# EAGLE design ziffy_board_v5 (EAGLE 6.5.0)
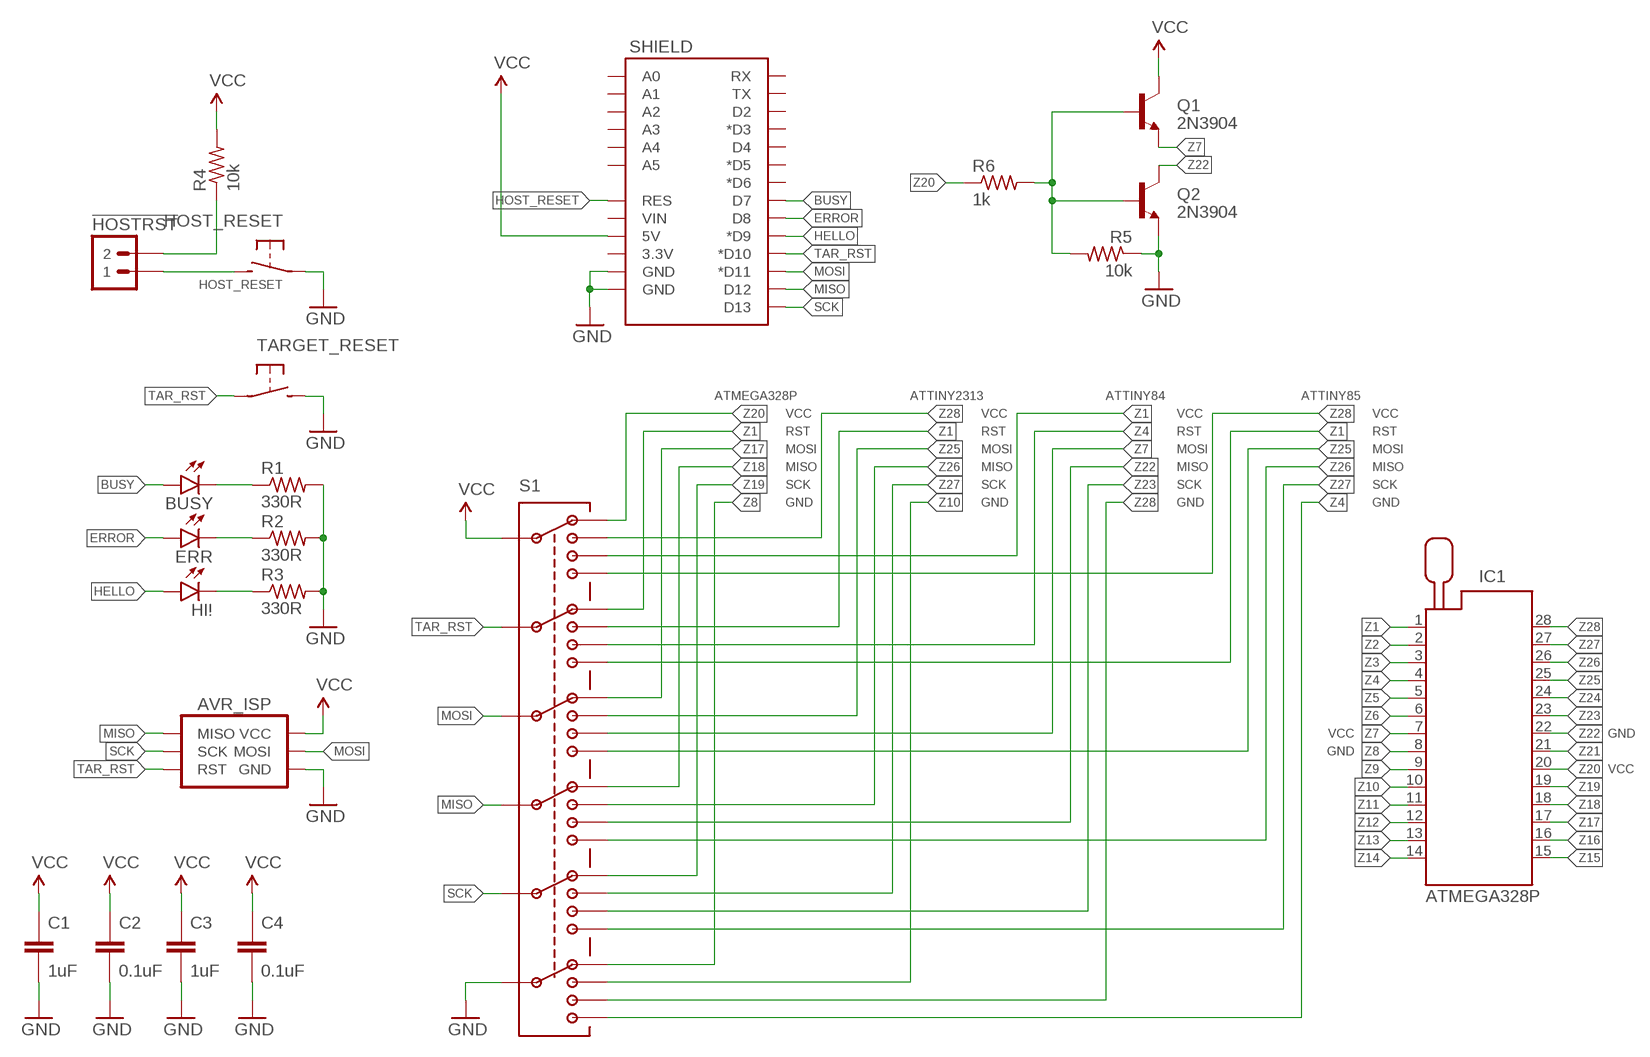
[diagram p0: schematic, sheet 1]

## Parts
!HOSTRST  M02PTH  [1X02]
AVR_ISP  AVR_SPI_PRG_6PTH-SHROUD  [2X3-SHROUDED]
BUSY  YELLOW  LED3MM  [LED3MM]
C1  1uF  CAPACITOR-CERAMIC025-024X044  [C025-024X044]
C2  0.1uF  CAPACITOR-CERAMIC025-024X044  [C025-024X044]
C3  1uF  CAPACITOR-CERAMIC025-024X044  [C025-024X044]
C4  0.1uF  CAPACITOR-CERAMIC025-024X044  [C025-024X044]
ERR  RED  LED3MM  [LED3MM]
HI!  GREEN  LED3MM  [LED3MM]
HOST_RESET  SPST-NO-TACT6MM-PTH-SMALL-PADS  [DTS-6-SMALL-PADS]
IC1  ATMEGA328P  ZIF28  [ZIF28]
Q1  2N3904  TRANSISTOR_NPNTO-92-AMMO-EBC  [TO-92-AMMO]
Q2  2N3904  TRANSISTOR_NPNTO-92-AMMO-EBC  [TO-92-AMMO]
R1  330R  RESISTORPTH-AXIAL-6.35MM  [RESISTOR-AXIAL-PTH-6.35MM]
R2  330R  RESISTORPTH-AXIAL-6.35MM  [RESISTOR-AXIAL-PTH-6.35MM]
R3  330R  RESISTORPTH-AXIAL-6.35MM  [RESISTOR-AXIAL-PTH-6.35MM]
R4  10k  RESISTORPTH-AXIAL-6.35MM  [RESISTOR-AXIAL-PTH-6.35MM]
R5  10k  RESISTORPTH-AXIAL-6.35MM  [RESISTOR-AXIAL-PTH-6.35MM]
R6  1k  RESISTORPTH-AXIAL-6.35MM  [RESISTOR-AXIAL-PTH-6.35MM]
S1  SWITCH-6P4TASDFADSFSD  [SWITCH-6P4T-2MMPTH]
SHIELD  ARDUINO_SHIELD_SMALLER  [ARDUINO_SHIELD_NOOUTLINE_INSIDE_SMALLER]
TARGET_RESET  SPST-NO-TACT6MM-PTH-SMALL-PADS  [DTS-6-SMALL-PADS]

## Nets
BUSY: BUSY.A SHIELD.D7
ERROR: ERR.A SHIELD.D8
GND: AVR_ISP.6(GND) C1.2 C2.2 C3.2 C4.2 HOST_RESET.1 HOST_RESET.2 Q2.1(E) R1.P$2 R2.P$2 R3.P$2 R5.P$1 S1.P28 SHIELD.GND@0(GND) SHIELD.GND@1(GND) TARGET_RESET.3 TARGET_RESET.4
HELLO: HI!.A SHIELD.D9(*D9)
HOST_RESET: !HOSTRST.1 HOST_RESET.3 HOST_RESET.4 SHIELD.RES
MISO: AVR_ISP.1(MISO) S1.P18 SHIELD.D12
MOSI: AVR_ISP.4(MOSI) S1.P13 SHIELD.D11(*D11)
N$1: BUSY.K(C) R1.P$1
N$2: ERR.K(C) R2.P$1
N$3: HI!.K(C) R3.P$1
N$4: !HOSTRST.2 R4.P$1
N$21: Q1.2(B) Q2.2(B) R5.P$2 R6.P$2
SCK: AVR_ISP.3(SCK) S1.P23 SHIELD.D13
TAR_RST: AVR_ISP.5(RST) S1.P8 SHIELD.D10(*D10) TARGET_RESET.1 TARGET_RESET.2
VCC: AVR_ISP.2(VCC) C1.1 C2.1 C3.1 C4.1 Q1.3(C) R4.P$2 S1.P3 SHIELD.5V
Z1: IC1.1 S1.P4 S1.P6 S1.P7 S1.P10
Z2: IC1.2
Z3: IC1.3
Z4: IC1.4 S1.P9 S1.P30
Z5: IC1.5
Z6: IC1.6
Z7: IC1.7 Q1.1(E) S1.P14
Z8: IC1.8 S1.P26
Z9: IC1.9
Z10: IC1.10 S1.P27
Z11: IC1.11
Z12: IC1.12
Z13: IC1.13
Z14: IC1.14
Z15: IC1.15
Z16: IC1.16
Z17: IC1.17 S1.P11
Z18: IC1.18 S1.P16
Z19: IC1.19 S1.P21
Z20: IC1.20 R6.P$1 S1.P1
Z21: IC1.21
Z22: IC1.22 Q2.3(C) S1.P19
Z23: IC1.23 S1.P24
Z24: IC1.24
Z25: IC1.25 S1.P12 S1.P15
Z26: IC1.26 S1.P17 S1.P20
Z27: IC1.27 S1.P22 S1.P25
Z28: IC1.28 S1.P2 S1.P5 S1.P29
Unconnected: SHIELD.3.3V SHIELD.A0 SHIELD.A1 SHIELD.A2 SHIELD.A3 SHIELD.A4 SHIELD.A5 SHIELD.D2 SHIELD.D3(*D3) SHIELD.D4 SHIELD.D5(*D5) SHIELD.D6(*D6) SHIELD.RX SHIELD.TX SHIELD.VIN

## Notes on the sheet
- ATMEGA328P | ATTINY2313 | ATTINY84 | ATTINY85
- VCC | VCC | VCC | VCC
- RST | RST | RST | RST
- MOSI | MOSI | MOSI | MOSI
- MISO | MISO | MISO | MISO
- SCK | SCK | SCK | SCK
- GND | GND | GND | GND
- VCC | GND
- GND
- VCC

## Library data of the parts
!HOSTRST = A_butts:M02: Standard 2-pin 0.1" header. Use with - straight break away headers ( PRT-00116) - right angle break away headers (PRT-00553) - swiss pins (PRT-00743) - machine pins (PRT-00117) - female headers (PRT-00115) Molex polarized connector foot print use with: PRT-08233 with associated crimp pins and housings. 2.54_SCREWTERM for use with PRT-10571. 3.5mm Screw Terminal footprints for PRT-08084 5mm Screw Terminal footprints for use with PRT-08433
AVR_ISP = A_butts:AVR_SPI_PRG_6: AVR ISP 6 Pin This is the reduced ISP connector for AVR programming. Common on Arduino. This footprint will take up less PCB space and can be used with a 10-pin to 6-pin adapter such as SKU: BOB-08508 **Special note about "TEST_POINT" package. The stop mask is on the top side, so if you want your programming test points to be on the bottom of your board, make sure to place this package on the bottom side of the board. This also ensure that the orientation to program from the bottom side will be correct.
BUSY ERR HI! = A_butts:LED: LEDs Standard schematic elements and footprints for 5mm, 3mm, 1206, and 0603 sized LEDs. 5mm - Spark Fun Electronics SKU : COM-00529 (and others)
C1-C4 = A_butts:CAPACITOR-CERAMIC: CAPACITOR, European symbol
HOST_RESET TARGET_RESET = A_butts:SPST-NO-TACT
IC1 = A_butts:ZIF28: Zero Insertion Force Socked Source: http://www.3M.com/ehpd
Q1 Q2 = A_butts:TRANSISTOR_NPN: Generic NPN BJT MMBT2222A - TRANS-08049 (SOT-23, 1A 40V) MPSA42 - TRANS-09116 (SOT-23, 500mA 300V) MMBT5088LT1G - TRANS-11160 (SOT-23, 50 mA 30V) BC547 - COM-08928 <http://www.sparkfun.com/products/8928> (TO-92 45V 100mA) (1.Collector 2.Base 3.Emitter) 2N3904 - COM-00521 <http://www.sparkfun.com/products/521> (TO-92 40V 200mA) (1.Emitter 2.Base 3.Collector) P2N2222A - COM-12852 <http://www.sparkfun.com/products/12852> (TO-92 40V 600mA) (1.Collector 2.Base 3.Emitter)
R1-R6 = A_butts:RESISTOR: RESISTOR, American symbol
S1 = A_butts:SWITCH-6P4T
SHIELD = A_butts:ARDUINO_SHIELD_SMALLER

## Board
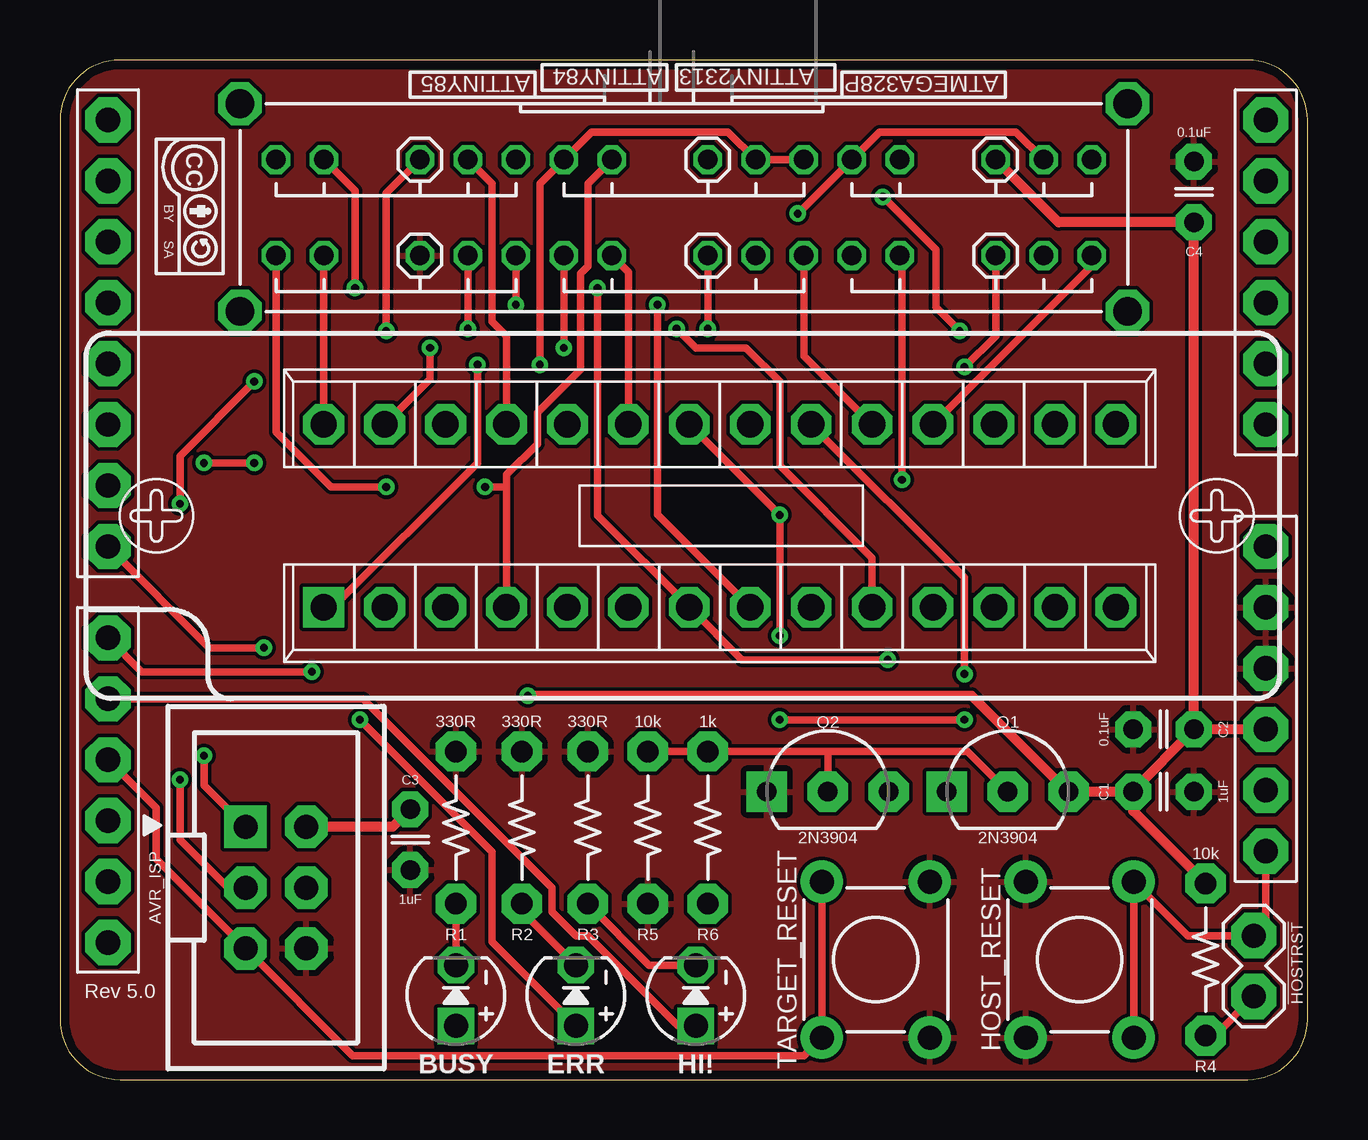
[diagram p1: board, top side]
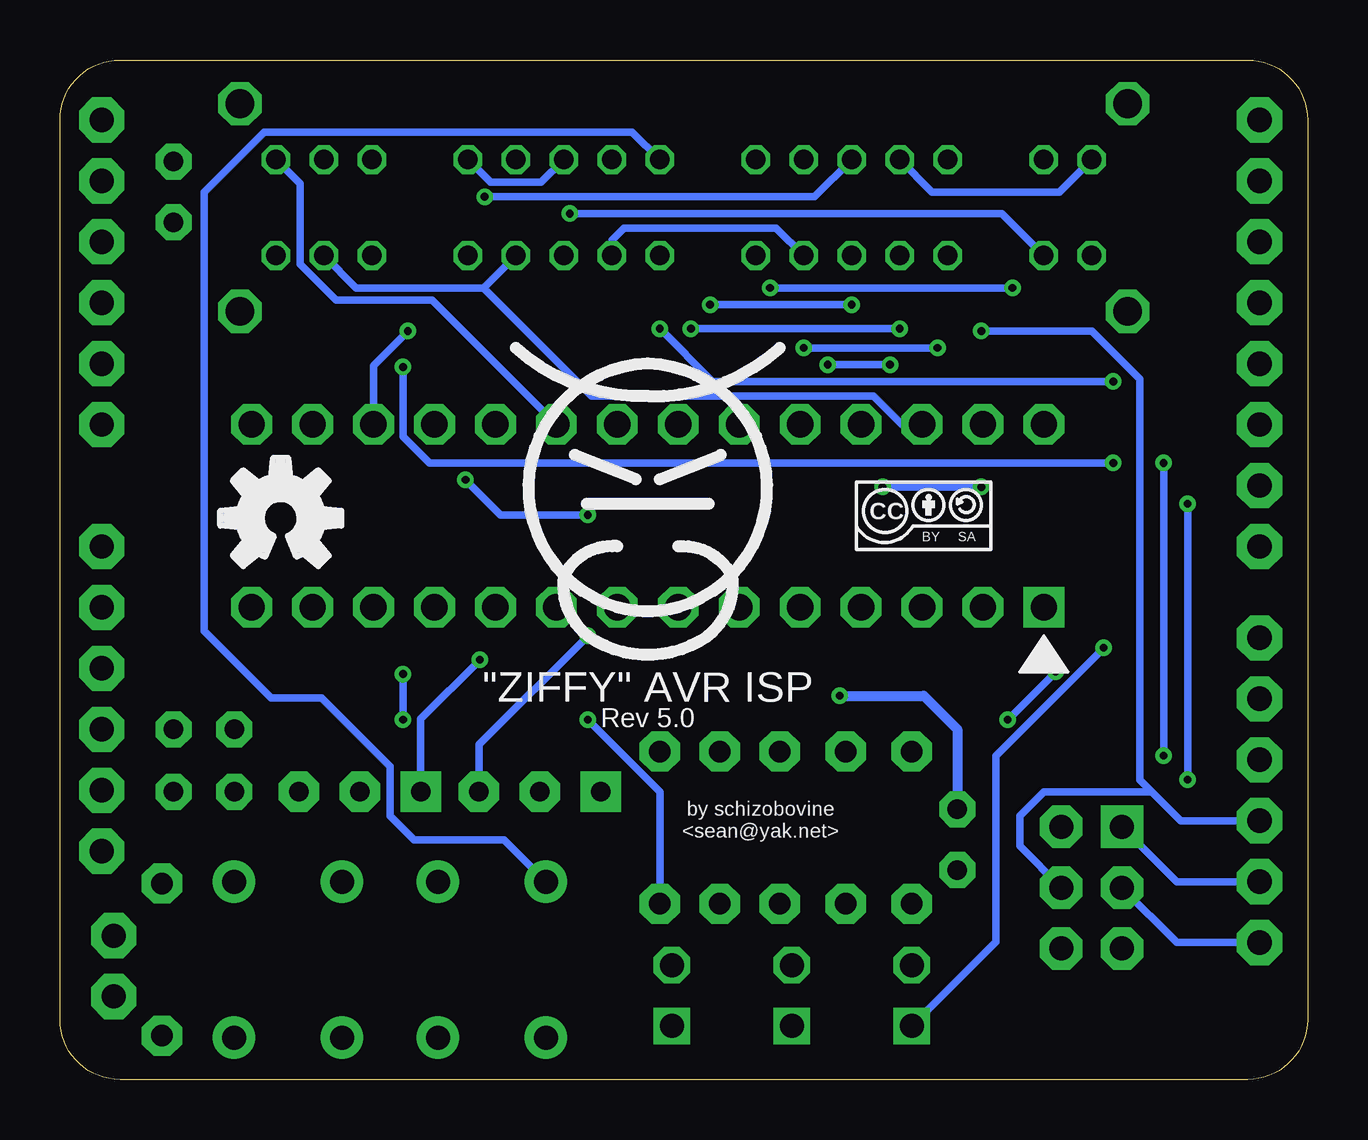
[diagram p2: board, bottom side, seen from below]

Size 52 x 42.5 mm. Coordinates in mm from the lower left corner, seen from the top.
Outline: 0,40 0,2.5 arc90 2.5,0 49.5,0 arc90 52,2.5 52,40 arc90 49.5,42.5 2.5,42.5 arc90 0,40
Copper layers (1*16): Top 0.0356mm / dielectric 1.5011mm / Bottom 0.0356mm
Design rules "LaenPCBOrder_2": minimum track width 6mil, minimum drill 13mil, track to track 6mil, track to pad 6mil, pad to pad 6mil, via to via 6mil, smd to smd 6mil, copper to edge 15mil, drill to drill 6mil, minimum pad ring 7mil, minimum via ring 7mil, stop-mask expansion 3mil, vias tented up to drill 20mil, thermal gap 10mil

### Footprints (pad centres in the part's own frame; a part is rotated, then mirrored left to right if it is on the bottom)
1X02 = drill 1 pad 1.88 octagon: 1 0,0; 2 2.54,0
2X3-SHROUDED = drill 1 pad 1.778 square: 1 -1.27,2.54 | drill 1 pad 1.778 octagon: 2 1.27,2.54; 3 -1.27,0; 4 1.27,0; 5 -1.27,-2.54; 6 1.27,-2.54
LED3MM = drill 1 pad 1.524 square: A -1.27,0 | drill 1 pad 1.524 octagon: K 1.27,0
C025-024X044 = drill 0.813 pad 1.5 octagon: 1 -1.27,0; 2 1.27,0
DTS-6-SMALL-PADS = drill 1 pad 1.778: 1 -3.25,2.25; 2 3.25,2.25; 3 -3.25,-2.25; 4 3.25,-2.25
ZIF28 = drill 1.1 pad 1.7 square: 1 -16.51,-3.81 | drill 1.1 pad 1.7 octagon: 2 -13.97,-3.81; 3 -11.43,-3.81; 4 -8.89,-3.81; 5 -6.35,-3.81; 6 -3.81,-3.81; 7 -1.27,-3.81; 8 1.27,-3.81; 9 3.81,-3.81; 10 6.35,-3.81; 11 8.89,-3.81; 12 11.43,-3.81; 13 13.97,-3.81; 14 16.51,-3.81; 15 16.51,3.81; 16 13.97,3.81; 17 11.43,3.81; 18 8.89,3.81; 19 6.35,3.81; 20 3.81,3.81; 21 1.27,3.81; 22 -1.27,3.81; 23 -3.81,3.81; 24 -6.35,3.81; 25 -8.89,3.81; 26 -11.43,3.81; 27 -13.97,3.81; 28 -16.51,3.81
TO-92-AMMO = drill 0.813 pad 1.676 square: 1 -2.54,0 | drill 0.813 pad 1.676 octagon: 2 0,0; 3 2.54,0
RESISTOR-AXIAL-PTH-6.35MM = drill 0.9 pad 1.676 octagon: P$1 -3.175,0; P$2 3.175,0
SWITCH-6P4T-2MMPTH = drill 0.8 octagon: P1 0,0; P2 2,0; P3 4,0; P4 8,0; P5 10,0; P6 12,0; P7 14,0; P8 16,0; P9 20,0; P10 22,0; P11 24,0; P12 26,0; P13 28,0; P14 32,0; P15 34,0; P16 0,4; P17 2,4; P18 4,4; P19 8,4; P20 10,4; P21 12,4; P22 14,4; P23 16,4; P24 20,4; P25 22,4; P26 24,4; P27 26,4; P28 28,4; P29 32,4; P30 34,4 | drill 1.2 octagon: POST1 -1.5,6.33; POST2 -1.5,-2.33; POST3 35.5,-2.33; POST4 35.5,6.33
ARDUINO_SHIELD_NOOUTLINE_INSIDE_SMALLER = drill 1.016 pad 1.88 octagon: 3.3V 48.26,-27.94; 5V 48.26,-25.4; A0 48.26,-12.7; A1 48.26,-10.16; A2 48.26,-7.62; A3 48.26,-5.08; A4 48.26,-2.54; A5 48.26,0; D2 0,-5.08; D3 0,-7.62; D4 0,-10.16; D5 0,-12.7; D6 0,-15.24; D7 0,-17.78; D8 0,-21.59; D9 0,-24.13; D10 0,-26.67; D11 0,-29.21; D12 0,-31.75; D13 0,-34.29; GND@0 48.26,-22.86; GND@1 48.26,-20.32; RES 48.26,-30.48; RX 0,0; TX 0,-2.54; VIN 48.26,-17.78

### Placement (x,y rotation side)
!HOSTRST  49.76,6 270 top
AVR_ISP  9,8 0 top
BUSY  16.5,3.5 90 top
C1  46,12 0 top
C2  46,14.6 180 top
C3  14.6,10 270 top
C4  47.27,37 90 top
ERR  21.5,3.5 90 top
HI!  26.5,3.5 90 top
HOST_RESET  42.5,5 90 top
IC1  27.5,23.5 0 top
Q1  39.5,12 0 top
Q2  32,12 0 top
R1  16.5,10.5 90 top
R2  19.25,10.5 90 top
R3  22,10.5 90 top
R4  47.75,5 90 top
R5  24.5,10.5 90 top
R6  27,10.5 90 top
S1  43,38.35 180 top
SHIELD  2,40 0 top
TARGET_RESET  34,5 90 top
U$1  [CC-BY-SA-4.0-NO-URL]  5.4,36.4 270 top
U$2  [COW]  27.5,23.5 0 bottom
U$3  [OSHWLOGO_BOT_0.2]  42.8,23.4 0 top
U$5  [CC-BY-SA-4.0-NO-URL]  16,23.5 0 bottom

### Tracks (layer width: path | path; a pad name or v marks a point on that pad's centre or on a via)
BUSY  (via drill 0.33)
  Top 0.305: SHIELD.D7 6.22,18 v8.5,18
  Bottom 0.305: v8.5,18 13,13.5 13,5.73 BUSY.A
ERROR  (via drill 0.33)
  Top 0.305: v12.5,15 18,9.5 18,5.73 ERR.A | v10.5,17 3.41,17 SHIELD.D8
  Bottom 0.305: v10.5,17 v12.5,15
GND
  pour Top: 2.5,42.5 49.5,42.5 arc-90 52,40 52,2.5 arc-90 49.5,0 2.5,0 arc-90 0,2.5 0,40 arc-90
HELLO
  Top 0.305: SHIELD.D9 12.63,15.87 20.5,8 20.5,7 21.5,6 22,6 25.77,2.23 HI!.A
HOST_RESET
  Top 0.305: SHIELD.RES 50.26,6.5 !HOSTRST.1 47,6 45,8 | 45,8 HOST_RESET.4 | HOST_RESET.3 44.75,7.75 45,8
MISO  (via drill 0.33)
  Top 0.305: AVR_ISP.1 6,12.27 v6,13.5 | v8.1,25.7 v6,25.7 | v37.7,29.7 39,31 S1.P18
  Bottom 0.305: SHIELD.D12 5.44,8.25 AVR_ISP.1 | v37.7,29.7 37.7,26.8 36.6,25.7 v8.1,25.7 | v6,25.7 v6,13.5
MOSI  (via drill 0.33)
  Top 0.305: v13.6,31.2 13.6,36.95 S1.P13
  Bottom 0.305: SHIELD.D11 5.29,10.79 6.5,12 | 6.5,12 7,12.5 7,29.2 9,31.2 v13.6,31.2 | AVR_ISP.4 12,9.73 12,11 11,12 6.5,12
N$1
  Top 0.305: BUSY.K R1.P$1
N$2
  Top 0.305: ERR.K 19.25,7.02 R2.P$1
N$3
  Top 0.305: HI!.K 24.55,4.77 R3.P$1
N$4
  Top 0.305: R4.P$1 48.12,1.82 !HOSTRST.2
N$21
  Top 0.305: R5.P$2 R6.P$2 32,13.68 | 32,13.68 37.83,13.68 Q1.2 | Q2.2 32,13.68
SCK  (via drill 0.33)
  Top 0.305: AVR_ISP.3 7,8 5,10 v5,12.5 | v8.1,29.1 5,26 v5,24 | v27,31.3 S1.P23
  Bottom 0.305: SHIELD.D13 5.44,5.71 AVR_ISP.3 | v5,12.5 v5,24 | v8.1,29.1 24.8,29.1 v27,31.3
TAR_RST
  Top 0.305: TARGET_RESET.2 TARGET_RESET.1 31,1 12.19,1 AVR_ISP.5 4,9.19 4,11.33 SHIELD.D10
  Bottom 0.305: TARGET_RESET.2 33.5,10 37.25,10 38.25,11 38.25,13.05 41.1,15.9 43.2,15.9 46,18.7 46,37 43.5,39.5 28.15,39.5 S1.P8
VCC  (via drill 0.33)
  Top 0.406: SHIELD.5V C2.1 | C2.1 C4.1 41.62,35.73 S1.P3 | C1.1 44.73,12.06 C2.1 | C1.1 44.73,11.2 R4.P$2 | C1.1 Q1.3 42,12 38,16 v19.5,16 | C3.1 13.87,10.54 AVR_ISP.2
  Bottom 0.406: v19.5,16 16,16 14.6,14.6 C3.1
Z1  (via drill 0.33)
  Top 0.305: IC1.1 11.39,19.69 17.4,25.7 v17.4,29.8 | v20,29.8 20,37.35 S1.P10 22.15,39.5 27.85,39.5 S1.P7 S1.P6
  Bottom 0.305: v17.4,29.8 v20,29.8 | S1.P6 31.95,37.4 34.05,37.4 S1.P4
Z4  (via drill 0.33)
  Top 0.305: IC1.4 18.61,24.7 | S1.P9 22,37.35 22,33.9 21.7,33.6 21.7,29.6 19.9,27.8 19.9,26.5 18.61,25.21 18.61,24.7 | S1.P30 9,27 11.3,24.7 v13.6,24.7 | v17.71,24.7 18.61,24.7
  Bottom 0.305: v13.6,24.7 v17.71,24.7
Z7  (via drill 0.33)
  Top 0.305: v34.5,17.5 28.42,17.5 IC1.7 22.4,23.52 v22.4,33 | S1.P14 12.3,37.05 v12.3,33
  Bottom 0.305: Q1.1 36.96,15.04 v34.5,17.5 | v12.3,33 v22.4,33
Z8  (via drill 0.33)
  Top 0.305: IC1.8 24.9,23.56 v24.9,32.3 | S1.P26 v19,32.3
  Bottom 0.305: v24.9,32.3 v19,32.3
Z10  (via drill 0.33)
  Top 0.305: IC1.10 33.85,21.75 30,25.6 30,29.1 28.6,30.5 26.5,30.5 v25.7,31.3 | v17,31.3 S1.P27
  Bottom 0.305: v25.7,31.3 v17,31.3
Z17  (via drill 0.33)
  Top 0.305: v37.5,31.2 36.5,32.2 36.5,34.6 v34.3,36.8
  Bottom 0.305: IC1.17 38.93,29.77 v37.5,31.2 | v34.3,36.8 20.55,36.8 S1.P11
Z18
  Top 0.305: S1.P16 43,33.92 IC1.18
Z19
  Top 0.305: S1.P21 31,30.16 IC1.19
Z20  (via drill 0.33)
  Top 0.305: v30,15 v37.7,15 | v37.7,16.9 37.7,20.92 IC1.20
  Bottom 0.305: R6.P$1 27,12 v30,15 | v37.7,15 v37.7,16.9 | IC1.20 36.5,32.5 40.5,32.5 42,34 42,37.35 S1.P1
Z22  (via drill 0.33)
  Top 0.305: v30,18.5 v30,23.54 IC1.22 | v35.1,25 35.1,34.25 S1.P19
  Bottom 0.305: Q2.3 34.54,13.96 v30,18.5 | v35.1,25 33.64,23.54 v30,23.54
Z23
  Top 0.305: IC1.23 23.69,33.66 S1.P24
Z25
  Top 0.305: IC1.25 18.61,30.99 18,31.6 18,37.35 S1.P12
  Bottom 0.305: S1.P15 10.35,37 15.65,37 S1.P12
Z26
  Bottom 0.305: S1.P17 39.65,33 34.35,33 | 34.35,33 S1.P20 | IC1.26 16.91,27.31 18.1,28.5 29.85,28.5 34.35,33
Z27  (via drill 0.33)
  Top 0.305: S1.P25 v21,30.5 | v15.42,30.5 15.42,29.2 IC1.27
  Bottom 0.305: S1.P22 29,35 28.5,35.5 22.15,35.5 S1.P25 | v21,30.5 v15.42,30.5
Z28  (via drill 0.33)
  Top 0.305: S1.P2 39.85,39.5 34.15,39.5 S1.P5 v30.75,36.1 | IC1.28 S1.P29
  Bottom 0.305: S1.P29 12.75,36.1 v30.75,36.1

### Text on the board
tPlace: ATTINY85 | ATTINY84 | ATTINY2313 | ATMEGA328P | Rev 5.0
bPlace: "ZIFFY" AVR ISP | Rev 5.0 | by schizobovine / <sean@yak.net>